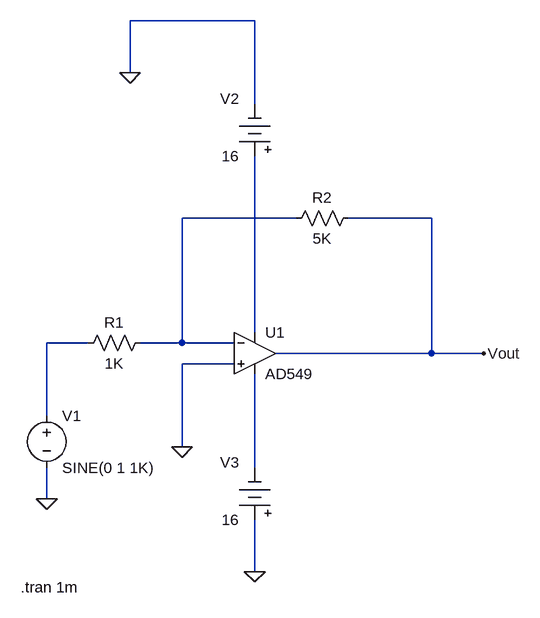
[diagram p0: schematic Draft3.asc]
Draft3.asc, the LTspice schematic file:
Version 4.1
SHEET 1 880 680
WIRE 384 -432 192 -432
WIRE 192 -352 192 -432
WIRE 384 -304 384 -432
WIRE 448 -128 272 -128
WIRE 656 -128 528 -128
WIRE 384 48 384 -224
WIRE 128 64 64 64
WIRE 272 64 272 -128
WIRE 272 64 208 64
WIRE 352 64 272 64
WIRE 656 80 656 -128
WIRE 656 80 416 80
WIRE 736 80 656 80
WIRE 352 96 272 96
WIRE 64 176 64 64
WIRE 272 224 272 96
WIRE 384 256 384 112
WIRE 64 304 64 256
WIRE 384 416 384 336
FLAG 64 304 0
FLAG 272 224 0
FLAG 736 80 Vout
FLAG 384 416 0
FLAG 192 -352 0
SYMBOL voltage 64 160 R0
WINDOW 123 0 0 Left 0
WINDOW 39 0 0 Left 0
SYMATTR InstName V1
SYMATTR Value SINE(0 1 1K)
SYMBOL OpAmps\\AD549 384 16 R0
SYMATTR InstName U1
SYMBOL res 224 48 R90
WINDOW 0 0 56 VBottom 2
WINDOW 3 32 56 VTop 2
SYMATTR InstName R1
SYMATTR Value 1K
SYMBOL res 544 -144 R90
WINDOW 0 0 56 VBottom 2
WINDOW 3 32 56 VTop 2
SYMATTR InstName R2
SYMATTR Value 5K
SYMBOL Misc\\battery 384 -208 R180
WINDOW 0 24 104 Left 2
WINDOW 3 24 16 Left 2
WINDOW 123 0 0 Left 0
WINDOW 39 0 0 Left 0
SYMATTR InstName V2
SYMATTR Value 16
SYMBOL Misc\\battery 384 352 R180
WINDOW 0 24 104 Left 2
WINDOW 3 24 16 Left 2
WINDOW 123 0 0 Left 0
WINDOW 39 0 0 Left 0
SYMATTR InstName V3
SYMATTR Value 16
TEXT 24 440 Left 2 !.tran 1m

The netlist it stands for:
* Draft3.asc
V1 N003 0 SINE(0 1 1K)
X§U1 0 N001 N002 N004 Vout AD549  ; pins In+ In- V+ V- OUT
R1 N001 N003 1K
R2 Vout N001 5K
V2 N002 0 16
V3 0 N004 16
.tran 1m
.backanno
.end